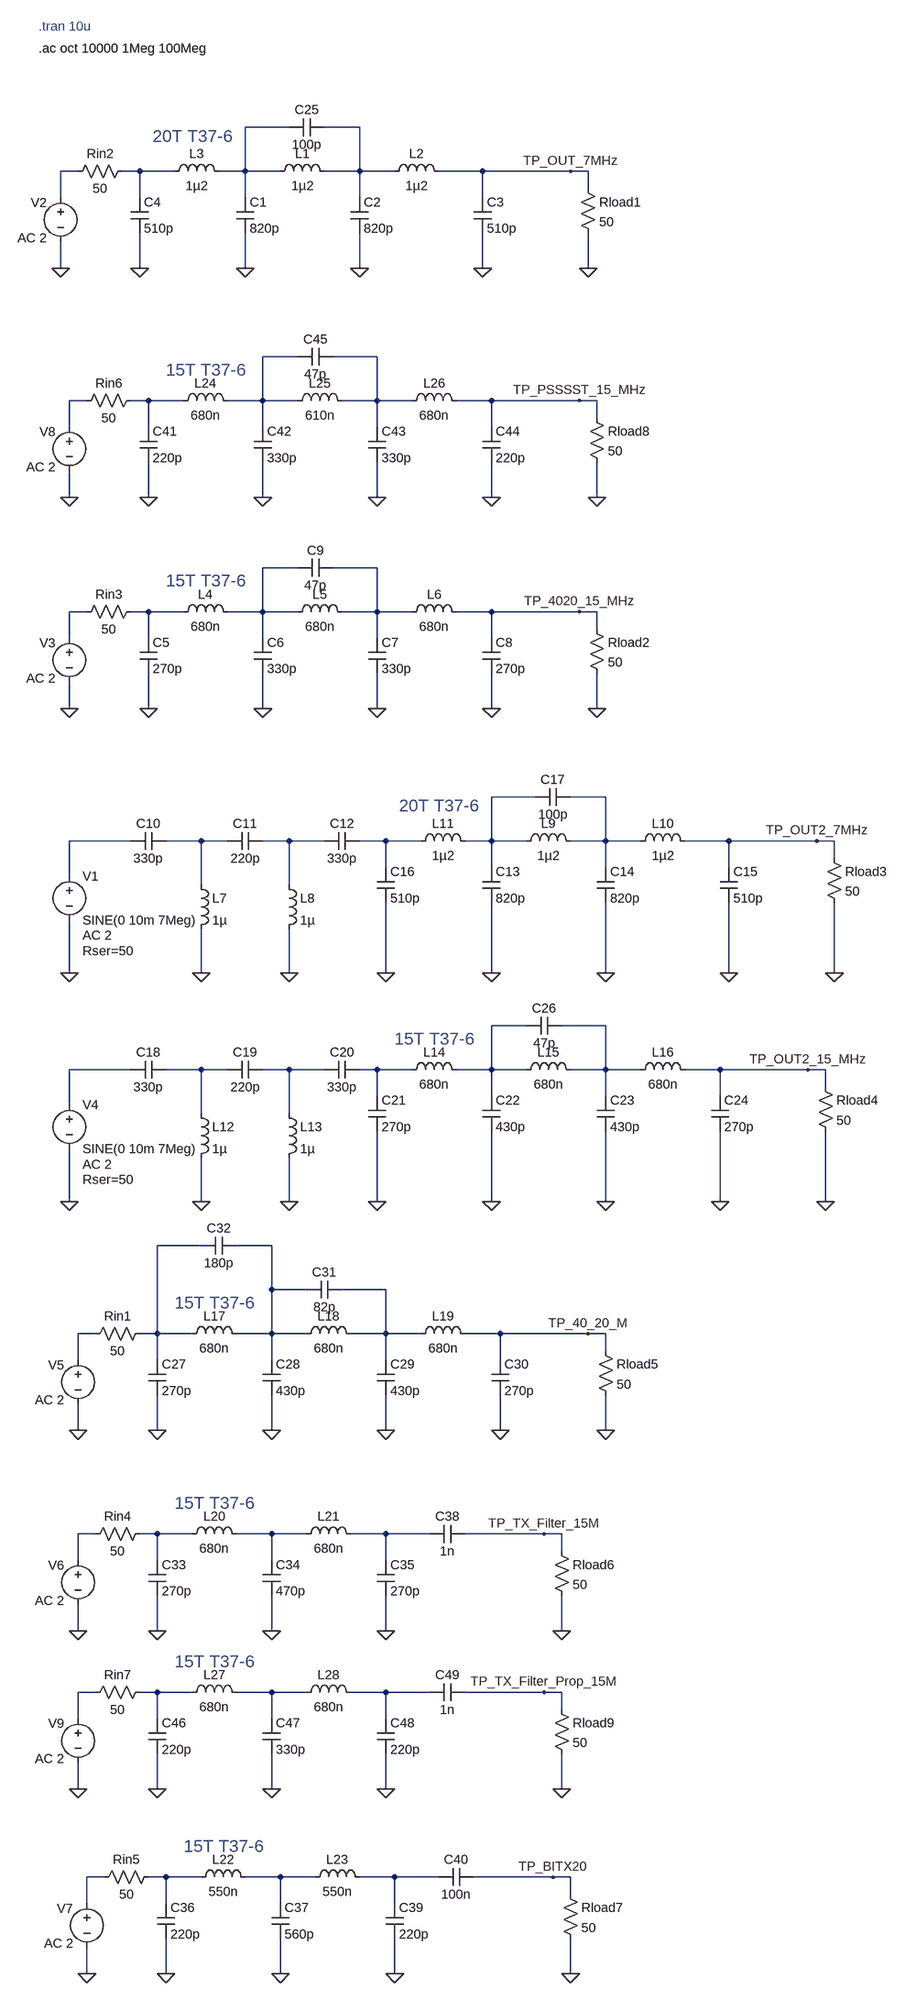
[diagram p0: schematic 4020 LPF Bode 1.asc]
4020 LPF Bode 1.asc, the LTspice schematic file:
Version 4
SHEET 1 1032 2628
WIRE -224 -912 -304 -912
WIRE -96 -912 -160 -912
WIRE -608 -832 -640 -832
WIRE -496 -832 -528 -832
WIRE -432 -832 -496 -832
WIRE -304 -832 -304 -912
WIRE -304 -832 -352 -832
WIRE -240 -832 -304 -832
WIRE -96 -832 -96 -912
WIRE -96 -832 -160 -832
WIRE -32 -832 -96 -832
WIRE 128 -832 48 -832
WIRE 288 -832 128 -832
WIRE 320 -832 288 -832
WIRE 320 -800 320 -832
WIRE -640 -784 -640 -832
WIRE -496 -784 -496 -832
WIRE -304 -784 -304 -832
WIRE -96 -784 -96 -832
WIRE 128 -784 128 -832
WIRE -640 -656 -640 -704
WIRE -496 -656 -496 -720
WIRE -304 -656 -304 -720
WIRE -96 -656 -96 -720
WIRE 128 -656 128 -720
WIRE 320 -656 320 -720
WIRE -208 -480 -272 -480
WIRE -64 -480 -144 -480
WIRE -592 -400 -624 -400
WIRE -480 -400 -512 -400
WIRE -416 -400 -480 -400
WIRE -272 -400 -272 -480
WIRE -272 -400 -336 -400
WIRE -208 -400 -272 -400
WIRE -64 -400 -64 -480
WIRE -64 -400 -128 -400
WIRE 0 -400 -64 -400
WIRE 144 -400 80 -400
WIRE 304 -400 144 -400
WIRE 336 -400 304 -400
WIRE 336 -368 336 -400
WIRE -624 -352 -624 -400
WIRE -480 -352 -480 -400
WIRE -272 -352 -272 -400
WIRE -64 -352 -64 -400
WIRE 144 -352 144 -400
WIRE -624 -224 -624 -272
WIRE -480 -224 -480 -288
WIRE -272 -224 -272 -288
WIRE -64 -224 -64 -288
WIRE 144 -224 144 -288
WIRE 336 -224 336 -288
WIRE -208 -96 -272 -96
WIRE -64 -96 -144 -96
WIRE -592 -16 -624 -16
WIRE -480 -16 -512 -16
WIRE -416 -16 -480 -16
WIRE -272 -16 -272 -96
WIRE -272 -16 -336 -16
WIRE -208 -16 -272 -16
WIRE -64 -16 -64 -96
WIRE -64 -16 -128 -16
WIRE 0 -16 -64 -16
WIRE 144 -16 80 -16
WIRE 304 -16 144 -16
WIRE 336 -16 304 -16
WIRE 336 16 336 -16
WIRE -624 32 -624 -16
WIRE -480 32 -480 -16
WIRE -272 32 -272 -16
WIRE -64 32 -64 -16
WIRE 144 32 144 -16
WIRE -624 160 -624 112
WIRE -480 160 -480 96
WIRE -272 160 -272 96
WIRE -64 160 -64 96
WIRE 144 160 144 96
WIRE 336 160 336 96
WIRE 224 336 144 336
WIRE 352 336 288 336
WIRE -512 416 -624 416
WIRE -384 416 -448 416
WIRE -336 416 -384 416
WIRE -224 416 -272 416
WIRE -160 416 -224 416
WIRE -48 416 -96 416
WIRE 16 416 -48 416
WIRE 144 416 144 336
WIRE 144 416 96 416
WIRE 208 416 144 416
WIRE 352 416 352 336
WIRE 352 416 288 416
WIRE 416 416 352 416
WIRE 576 416 496 416
WIRE 736 416 576 416
WIRE 768 416 736 416
WIRE 768 448 768 416
WIRE -48 464 -48 416
WIRE 144 464 144 416
WIRE 352 464 352 416
WIRE 576 464 576 416
WIRE -624 480 -624 416
WIRE -384 496 -384 416
WIRE -224 496 -224 416
WIRE -624 656 -624 560
WIRE -384 656 -384 576
WIRE -224 656 -224 576
WIRE -48 656 -48 528
WIRE 144 656 144 528
WIRE 352 656 352 528
WIRE 576 656 576 528
WIRE 768 656 768 528
WIRE 208 752 144 752
WIRE 352 752 272 752
WIRE -512 832 -624 832
WIRE -384 832 -448 832
WIRE -336 832 -384 832
WIRE -224 832 -272 832
WIRE -160 832 -224 832
WIRE -64 832 -96 832
WIRE 0 832 -64 832
WIRE 144 832 144 752
WIRE 144 832 80 832
WIRE 208 832 144 832
WIRE 352 832 352 752
WIRE 352 832 288 832
WIRE 416 832 352 832
WIRE 560 832 496 832
WIRE 720 832 560 832
WIRE 752 832 720 832
WIRE 752 864 752 832
WIRE -64 880 -64 832
WIRE 144 880 144 832
WIRE 352 880 352 832
WIRE 560 880 560 832
WIRE -624 896 -624 832
WIRE -384 912 -384 832
WIRE -224 912 -224 832
WIRE -624 1072 -624 976
WIRE -384 1072 -384 992
WIRE -224 1072 -224 992
WIRE -64 1072 -64 944
WIRE 144 1072 144 944
WIRE 352 1072 352 944
WIRE 560 1072 560 944
WIRE 752 1072 752 944
WIRE -384 1152 -464 1152
WIRE -256 1152 -320 1152
WIRE -256 1232 -256 1152
WIRE -192 1232 -256 1232
WIRE -48 1232 -128 1232
WIRE -576 1312 -608 1312
WIRE -464 1312 -464 1152
WIRE -464 1312 -496 1312
WIRE -400 1312 -464 1312
WIRE -256 1312 -256 1232
WIRE -256 1312 -320 1312
WIRE -192 1312 -256 1312
WIRE -48 1312 -48 1232
WIRE -48 1312 -112 1312
WIRE 16 1312 -48 1312
WIRE 160 1312 96 1312
WIRE 320 1312 160 1312
WIRE 352 1312 320 1312
WIRE 352 1344 352 1312
WIRE -608 1360 -608 1312
WIRE -464 1360 -464 1312
WIRE -256 1360 -256 1312
WIRE -48 1360 -48 1312
WIRE 160 1360 160 1312
WIRE -608 1488 -608 1440
WIRE -464 1488 -464 1424
WIRE -256 1488 -256 1424
WIRE -48 1488 -48 1424
WIRE 160 1488 160 1424
WIRE 352 1488 352 1424
WIRE -576 1808 -608 1808
WIRE -464 1808 -496 1808
WIRE -400 1808 -464 1808
WIRE -256 1808 -320 1808
WIRE -192 1808 -256 1808
WIRE -48 1808 -112 1808
WIRE 32 1808 -48 1808
WIRE 240 1808 96 1808
WIRE 272 1808 240 1808
WIRE 272 1840 272 1808
WIRE -608 1856 -608 1808
WIRE -464 1856 -464 1808
WIRE -256 1856 -256 1808
WIRE -48 1856 -48 1808
WIRE -608 1984 -608 1936
WIRE -464 1984 -464 1920
WIRE -256 1984 -256 1920
WIRE -48 1984 -48 1920
WIRE 272 1984 272 1920
WIRE -576 2096 -608 2096
WIRE -464 2096 -496 2096
WIRE -400 2096 -464 2096
WIRE -256 2096 -320 2096
WIRE -192 2096 -256 2096
WIRE -48 2096 -112 2096
WIRE 32 2096 -48 2096
WIRE 240 2096 96 2096
WIRE 272 2096 240 2096
WIRE 272 2128 272 2096
WIRE -608 2144 -608 2096
WIRE -464 2144 -464 2096
WIRE -256 2144 -256 2096
WIRE -48 2144 -48 2096
WIRE -608 2272 -608 2224
WIRE -464 2272 -464 2208
WIRE -256 2272 -256 2208
WIRE -48 2272 -48 2208
WIRE 272 2272 272 2208
WIRE -560 2432 -592 2432
WIRE -448 2432 -480 2432
WIRE -384 2432 -448 2432
WIRE -240 2432 -304 2432
WIRE -176 2432 -240 2432
WIRE -32 2432 -96 2432
WIRE 48 2432 -32 2432
WIRE 256 2432 112 2432
WIRE 288 2432 256 2432
WIRE 288 2464 288 2432
WIRE -592 2480 -592 2432
WIRE -448 2480 -448 2432
WIRE -240 2480 -240 2432
WIRE -32 2480 -32 2432
WIRE -592 2608 -592 2560
WIRE -448 2608 -448 2544
WIRE -240 2608 -240 2544
WIRE -32 2608 -32 2544
WIRE 288 2608 288 2544
FLAG 320 -656 0
FLAG 288 -832 TP_OUT_7MHz
FLAG -304 -656 0
FLAG -96 -656 0
FLAG 128 -656 0
FLAG -496 -656 0
FLAG -480 160 0
FLAG -272 160 0
FLAG -64 160 0
FLAG 336 160 0
FLAG 304 -16 TP_4020_15_MHz
FLAG 144 160 0
FLAG -640 -656 0
FLAG -624 160 0
FLAG -624 656 0
FLAG -224 656 0
FLAG -384 656 0
FLAG 768 656 0
FLAG 736 416 TP_OUT2_7MHz
FLAG 144 656 0
FLAG 352 656 0
FLAG 576 656 0
FLAG -48 656 0
FLAG -624 1072 0
FLAG -224 1072 0
FLAG -384 1072 0
FLAG -64 1072 0
FLAG 144 1072 0
FLAG 352 1072 0
FLAG 752 1072 0
FLAG 720 832 TP_OUT2_15_MHz
FLAG 560 1072 0
FLAG -464 1488 0
FLAG -256 1488 0
FLAG -48 1488 0
FLAG 352 1488 0
FLAG 320 1312 TP_40_20_M
FLAG 160 1488 0
FLAG -608 1488 0
FLAG -464 1984 0
FLAG -256 1984 0
FLAG -48 1984 0
FLAG 272 1984 0
FLAG 240 1808 TP_TX_Filter_15M
FLAG -608 1984 0
FLAG -448 2608 0
FLAG -240 2608 0
FLAG -32 2608 0
FLAG 288 2608 0
FLAG 256 2432 TP_BITX20
FLAG -592 2608 0
FLAG -480 -224 0
FLAG -272 -224 0
FLAG -64 -224 0
FLAG 336 -224 0
FLAG 304 -400 TP_PSSSST_15_MHz
FLAG 144 -224 0
FLAG -624 -224 0
FLAG -464 2272 0
FLAG -256 2272 0
FLAG -48 2272 0
FLAG 272 2272 0
FLAG 240 2096 TP_TX_Filter_Prop_15M
FLAG -608 2272 0
SYMBOL res 304 -816 R0
SYMATTR InstName Rload1
SYMATTR Value 50
SYMBOL cap -320 -784 R0
SYMATTR InstName C1
SYMATTR Value 820p
SYMBOL cap -112 -784 R0
SYMATTR InstName C2
SYMATTR Value 820p
SYMBOL ind -256 -816 R270
WINDOW 0 32 56 VTop 2
WINDOW 3 5 56 VBottom 2
SYMATTR InstName L1
SYMATTR Value 1µ2
SYMATTR SpiceLine Rser=80m
SYMBOL ind -48 -816 R270
WINDOW 0 32 56 VTop 2
WINDOW 3 5 56 VBottom 2
SYMATTR InstName L2
SYMATTR Value 1µ2
SYMATTR SpiceLine Rser=80m
SYMBOL cap 112 -784 R0
SYMATTR InstName C3
SYMATTR Value 510p
SYMBOL cap -512 -784 R0
SYMATTR InstName C4
SYMATTR Value 510p
SYMBOL ind -448 -816 R270
WINDOW 0 32 56 VTop 2
WINDOW 3 5 56 VBottom 2
SYMATTR InstName L3
SYMATTR Value 1µ2
SYMATTR SpiceLine Rser=80m
SYMBOL cap -496 32 R0
SYMATTR InstName C5
SYMATTR Value 270p
SYMBOL cap -288 32 R0
SYMATTR InstName C6
SYMATTR Value 330p
SYMBOL ind -432 0 R270
WINDOW 0 32 56 VTop 2
WINDOW 3 5 56 VBottom 2
SYMATTR InstName L4
SYMATTR Value 680n
SYMBOL ind -224 0 R270
WINDOW 0 32 56 VTop 2
WINDOW 3 5 56 VBottom 2
SYMATTR InstName L5
SYMATTR Value 680n
SYMBOL cap -80 32 R0
SYMATTR InstName C7
SYMATTR Value 330p
SYMBOL res 320 0 R0
SYMATTR InstName Rload2
SYMATTR Value 50
SYMBOL ind -16 0 R270
WINDOW 0 32 56 VTop 2
WINDOW 3 5 56 VBottom 2
SYMATTR InstName L6
SYMATTR Value 680n
SYMBOL cap 128 32 R0
SYMATTR InstName C8
SYMATTR Value 270p
SYMBOL cap -144 -112 R90
WINDOW 0 0 32 VBottom 2
WINDOW 3 32 32 VTop 2
SYMATTR InstName C9
SYMATTR Value 47p
SYMBOL voltage -640 -800 M0
WINDOW 123 25 89 Left 2
WINDOW 39 0 0 Left 2
WINDOW 0 25 25 Left 2
WINDOW 3 24 104 Invisible 2
SYMATTR Value2 AC 2
SYMATTR InstName V2
SYMATTR Value SINE(0 63 7.1Meg)
SYMBOL res -624 -816 R270
WINDOW 0 32 56 VTop 2
WINDOW 3 0 56 VBottom 2
SYMATTR InstName Rin2
SYMATTR Value 50
SYMBOL voltage -624 16 M0
WINDOW 123 25 89 Left 2
WINDOW 39 0 0 Left 2
WINDOW 0 25 25 Left 2
WINDOW 3 24 104 Invisible 2
SYMATTR Value2 AC 2
SYMATTR InstName V3
SYMATTR Value SINE(0 63 14Meg)
SYMBOL res -608 0 R270
WINDOW 0 32 56 VTop 2
WINDOW 3 0 56 VBottom 2
SYMATTR InstName Rin3
SYMATTR Value 50
SYMBOL cap -160 -928 R90
WINDOW 0 0 32 VBottom 2
WINDOW 3 32 32 VTop 2
SYMATTR InstName C25
SYMATTR Value 100p
SYMBOL voltage -624 464 R0
WINDOW 123 24 124 Left 2
WINDOW 39 24 152 Left 2
SYMATTR Value2 AC 2
SYMATTR SpiceLine Rser=50
SYMATTR InstName V1
SYMATTR Value SINE(0 10m 7Meg)
SYMBOL cap -448 400 R90
WINDOW 0 0 32 VBottom 2
WINDOW 3 32 32 VTop 2
SYMATTR InstName C10
SYMATTR Value 330p
SYMBOL ind -400 480 R0
SYMATTR InstName L7
SYMATTR Value 1µ
SYMBOL cap -272 400 R90
WINDOW 0 0 32 VBottom 2
WINDOW 3 32 32 VTop 2
SYMATTR InstName C11
SYMATTR Value 220p
SYMBOL cap -96 400 R90
WINDOW 0 0 32 VBottom 2
WINDOW 3 32 32 VTop 2
SYMATTR InstName C12
SYMATTR Value 330p
SYMBOL ind -240 480 R0
SYMATTR InstName L8
SYMATTR Value 1µ
SYMBOL res 752 432 R0
SYMATTR InstName Rload3
SYMATTR Value 50
SYMBOL cap 128 464 R0
SYMATTR InstName C13
SYMATTR Value 820p
SYMBOL cap 336 464 R0
SYMATTR InstName C14
SYMATTR Value 820p
SYMBOL ind 192 432 R270
WINDOW 0 32 56 VTop 2
WINDOW 3 5 56 VBottom 2
SYMATTR InstName L9
SYMATTR Value 1µ2
SYMATTR SpiceLine Rser=80m
SYMBOL ind 400 432 R270
WINDOW 0 32 56 VTop 2
WINDOW 3 5 56 VBottom 2
SYMATTR InstName L10
SYMATTR Value 1µ2
SYMATTR SpiceLine Rser=80m
SYMBOL cap 560 464 R0
SYMATTR InstName C15
SYMATTR Value 510p
SYMBOL cap -64 464 R0
SYMATTR InstName C16
SYMATTR Value 510p
SYMBOL ind 0 432 R270
WINDOW 0 32 56 VTop 2
WINDOW 3 5 56 VBottom 2
SYMATTR InstName L11
SYMATTR Value 1µ2
SYMATTR SpiceLine Rser=80m
SYMBOL cap 288 320 R90
WINDOW 0 0 32 VBottom 2
WINDOW 3 32 32 VTop 2
SYMATTR InstName C17
SYMATTR Value 100p
SYMBOL voltage -624 880 R0
WINDOW 123 24 124 Left 2
WINDOW 39 24 152 Left 2
SYMATTR Value2 AC 2
SYMATTR SpiceLine Rser=50
SYMATTR InstName V4
SYMATTR Value SINE(0 10m 7Meg)
SYMBOL cap -448 816 R90
WINDOW 0 0 32 VBottom 2
WINDOW 3 32 32 VTop 2
SYMATTR InstName C18
SYMATTR Value 330p
SYMBOL ind -400 896 R0
SYMATTR InstName L12
SYMATTR Value 1µ
SYMBOL cap -272 816 R90
WINDOW 0 0 32 VBottom 2
WINDOW 3 32 32 VTop 2
SYMATTR InstName C19
SYMATTR Value 220p
SYMBOL cap -96 816 R90
WINDOW 0 0 32 VBottom 2
WINDOW 3 32 32 VTop 2
SYMATTR InstName C20
SYMATTR Value 330p
SYMBOL ind -240 896 R0
SYMATTR InstName L13
SYMATTR Value 1µ
SYMBOL cap -80 880 R0
SYMATTR InstName C21
SYMATTR Value 270p
SYMBOL cap 128 880 R0
SYMATTR InstName C22
SYMATTR Value 430p
SYMBOL ind -16 848 R270
WINDOW 0 32 56 VTop 2
WINDOW 3 5 56 VBottom 2
SYMATTR InstName L14
SYMATTR Value 680n
SYMBOL ind 192 848 R270
WINDOW 0 32 56 VTop 2
WINDOW 3 5 56 VBottom 2
SYMATTR InstName L15
SYMATTR Value 680n
SYMBOL cap 336 880 R0
SYMATTR InstName C23
SYMATTR Value 430p
SYMBOL res 736 848 R0
SYMATTR InstName Rload4
SYMATTR Value 50
SYMBOL ind 400 848 R270
WINDOW 0 32 56 VTop 2
WINDOW 3 5 56 VBottom 2
SYMATTR InstName L16
SYMATTR Value 680n
SYMBOL cap 544 880 R0
SYMATTR InstName C24
SYMATTR Value 270p
SYMBOL cap 272 736 R90
WINDOW 0 0 32 VBottom 2
WINDOW 3 32 32 VTop 2
SYMATTR InstName C26
SYMATTR Value 47p
SYMBOL cap -480 1360 R0
SYMATTR InstName C27
SYMATTR Value 270p
SYMBOL cap -272 1360 R0
SYMATTR InstName C28
SYMATTR Value 430p
SYMBOL ind -416 1328 R270
WINDOW 0 32 56 VTop 2
WINDOW 3 5 56 VBottom 2
SYMATTR InstName L17
SYMATTR Value 680n
SYMBOL ind -208 1328 R270
WINDOW 0 32 56 VTop 2
WINDOW 3 5 56 VBottom 2
SYMATTR InstName L18
SYMATTR Value 680n
SYMBOL cap -64 1360 R0
SYMATTR InstName C29
SYMATTR Value 430p
SYMBOL res 336 1328 R0
SYMATTR InstName Rload5
SYMATTR Value 50
SYMBOL ind 0 1328 R270
WINDOW 0 32 56 VTop 2
WINDOW 3 5 56 VBottom 2
SYMATTR InstName L19
SYMATTR Value 680n
SYMBOL cap 144 1360 R0
SYMATTR InstName C30
SYMATTR Value 270p
SYMBOL cap -128 1216 R90
WINDOW 0 0 32 VBottom 2
WINDOW 3 32 32 VTop 2
SYMATTR InstName C31
SYMATTR Value 82p
SYMBOL voltage -608 1344 M0
WINDOW 123 25 89 Left 2
WINDOW 39 0 0 Left 2
WINDOW 0 25 25 Left 2
WINDOW 3 24 104 Invisible 2
SYMATTR Value2 AC 2
SYMATTR InstName V5
SYMATTR Value SINE(0 30 28Meg)
SYMBOL res -592 1328 R270
WINDOW 0 32 56 VTop 2
WINDOW 3 0 56 VBottom 2
SYMATTR InstName Rin1
SYMATTR Value 50
SYMBOL cap -320 1136 R90
WINDOW 0 0 32 VBottom 2
WINDOW 3 32 32 VTop 2
SYMATTR InstName C32
SYMATTR Value 180p
SYMBOL cap -480 1856 R0
SYMATTR InstName C33
SYMATTR Value 270p
SYMBOL cap -272 1856 R0
SYMATTR InstName C34
SYMATTR Value 470p
SYMBOL ind -416 1824 R270
WINDOW 0 32 56 VTop 2
WINDOW 3 5 56 VBottom 2
SYMATTR InstName L20
SYMATTR Value 680n
SYMBOL ind -208 1824 R270
WINDOW 0 32 56 VTop 2
WINDOW 3 5 56 VBottom 2
SYMATTR InstName L21
SYMATTR Value 680n
SYMBOL cap -64 1856 R0
SYMATTR InstName C35
SYMATTR Value 270p
SYMBOL res 256 1824 R0
SYMATTR InstName Rload6
SYMATTR Value 50
SYMBOL voltage -608 1840 M0
WINDOW 123 25 89 Left 2
WINDOW 39 0 0 Left 2
WINDOW 0 25 25 Left 2
WINDOW 3 24 104 Invisible 2
SYMATTR Value2 AC 2
SYMATTR InstName V6
SYMATTR Value SINE(0 30 28Meg)
SYMBOL res -592 1824 R270
WINDOW 0 32 56 VTop 2
WINDOW 3 0 56 VBottom 2
SYMATTR InstName Rin4
SYMATTR Value 50
SYMBOL cap 96 1792 R90
WINDOW 0 0 32 VBottom 2
WINDOW 3 32 32 VTop 2
SYMATTR InstName C38
SYMATTR Value 1n
SYMBOL cap -464 2480 R0
SYMATTR InstName C36
SYMATTR Value 220p
SYMBOL cap -256 2480 R0
SYMATTR InstName C37
SYMATTR Value 560p
SYMBOL ind -400 2448 R270
WINDOW 0 32 56 VTop 2
WINDOW 3 5 56 VBottom 2
SYMATTR InstName L22
SYMATTR Value 550n
SYMBOL ind -192 2448 R270
WINDOW 0 32 56 VTop 2
WINDOW 3 5 56 VBottom 2
SYMATTR InstName L23
SYMATTR Value 550n
SYMBOL cap -48 2480 R0
SYMATTR InstName C39
SYMATTR Value 220p
SYMBOL res 272 2448 R0
SYMATTR InstName Rload7
SYMATTR Value 50
SYMBOL voltage -592 2464 M0
WINDOW 123 25 89 Left 2
WINDOW 39 0 0 Left 2
WINDOW 0 25 25 Left 2
WINDOW 3 24 104 Invisible 2
SYMATTR Value2 AC 2
SYMATTR InstName V7
SYMATTR Value SINE(0 30 28Meg)
SYMBOL res -576 2448 R270
WINDOW 0 32 56 VTop 2
WINDOW 3 0 56 VBottom 2
SYMATTR InstName Rin5
SYMATTR Value 50
SYMBOL cap 112 2416 R90
WINDOW 0 0 32 VBottom 2
WINDOW 3 32 32 VTop 2
SYMATTR InstName C40
SYMATTR Value 100n
SYMBOL cap -496 -352 R0
SYMATTR InstName C41
SYMATTR Value 220p
SYMBOL cap -288 -352 R0
SYMATTR InstName C42
SYMATTR Value 330p
SYMBOL ind -432 -384 R270
WINDOW 0 32 56 VTop 2
WINDOW 3 5 56 VBottom 2
SYMATTR InstName L24
SYMATTR Value 680n
SYMBOL ind -224 -384 R270
WINDOW 0 32 56 VTop 2
WINDOW 3 5 56 VBottom 2
SYMATTR InstName L25
SYMATTR Value 610n
SYMBOL cap -80 -352 R0
SYMATTR InstName C43
SYMATTR Value 330p
SYMBOL res 320 -384 R0
SYMATTR InstName Rload8
SYMATTR Value 50
SYMBOL ind -16 -384 R270
WINDOW 0 32 56 VTop 2
WINDOW 3 5 56 VBottom 2
SYMATTR InstName L26
SYMATTR Value 680n
SYMBOL cap 128 -352 R0
SYMATTR InstName C44
SYMATTR Value 220p
SYMBOL cap -144 -496 R90
WINDOW 0 0 32 VBottom 2
WINDOW 3 32 32 VTop 2
SYMATTR InstName C45
SYMATTR Value 47p
SYMBOL voltage -624 -368 M0
WINDOW 123 25 89 Left 2
WINDOW 39 0 0 Left 2
WINDOW 0 25 25 Left 2
WINDOW 3 24 104 Invisible 2
SYMATTR Value2 AC 2
SYMATTR InstName V8
SYMATTR Value SINE(0 63 14Meg)
SYMBOL res -608 -384 R270
WINDOW 0 32 56 VTop 2
WINDOW 3 0 56 VBottom 2
SYMATTR InstName Rin6
SYMATTR Value 50
SYMBOL cap -480 2144 R0
SYMATTR InstName C46
SYMATTR Value 220p
SYMBOL cap -272 2144 R0
SYMATTR InstName C47
SYMATTR Value 330p
SYMBOL ind -416 2112 R270
WINDOW 0 32 56 VTop 2
WINDOW 3 5 56 VBottom 2
SYMATTR InstName L27
SYMATTR Value 680n
SYMBOL ind -208 2112 R270
WINDOW 0 32 56 VTop 2
WINDOW 3 5 56 VBottom 2
SYMATTR InstName L28
SYMATTR Value 680n
SYMBOL cap -64 2144 R0
SYMATTR InstName C48
SYMATTR Value 220p
SYMBOL res 256 2112 R0
SYMATTR InstName Rload9
SYMATTR Value 50
SYMBOL voltage -608 2128 M0
WINDOW 123 25 89 Left 2
WINDOW 39 0 0 Left 2
WINDOW 0 25 25 Left 2
WINDOW 3 24 104 Invisible 2
SYMATTR Value2 AC 2
SYMATTR InstName V9
SYMATTR Value SINE(0 30 28Meg)
SYMBOL res -592 2112 R270
WINDOW 0 32 56 VTop 2
WINDOW 3 0 56 VBottom 2
SYMATTR InstName Rin7
SYMATTR Value 50
SYMBOL cap 96 2080 R90
WINDOW 0 0 32 VBottom 2
WINDOW 3 32 32 VTop 2
SYMATTR InstName C49
SYMATTR Value 1n
TEXT -448 -72 Left 3 ;15T T37-6
TEXT -680 -1056 Left 2 !.ac oct 10000 1Meg 100Meg
TEXT -680 -1096 Left 2 ;.tran 10u
TEXT -472 -896 Left 3 ;20T T37-6
TEXT -24 352 Left 3 ;20T T37-6
TEXT -32 776 Left 3 ;15T T37-6
TEXT -432 1256 Left 3 ;15T T37-6
TEXT -432 1752 Left 3 ;15T T37-6
TEXT -416 2376 Left 3 ;15T T37-6
TEXT -448 -456 Left 3 ;15T T37-6
TEXT -432 2040 Left 3 ;15T T37-6

The netlist it stands for:
* 4020 LPF Bode 1.asc
Rload1 TP_OUT_7MHz 0 50
C1 N001 0 820p
C2 N002 0 820p
L1 N001 N002 1µ2 Rser=80m
L2 N002 TP_OUT_7MHz 1µ2 Rser=80m
C3 TP_OUT_7MHz 0 510p
C4 N004 0 510p
L3 N004 N001 1µ2 Rser=80m
C5 N012 0 270p
C6 N009 0 330p
L4 N012 N009 680n
L5 N009 N010 680n
C7 N010 0 330p
Rload2 TP_4020_15_MHz 0 50
L6 N010 TP_4020_15_MHz 680n
C8 TP_4020_15_MHz 0 270p
C9 N010 N009 47p
V2 N003 0 SINE(0 63 7.1Meg) AC 2
Rin2 N003 N004 50
V3 N011 0 SINE(0 63 14Meg) AC 2
Rin3 N011 N012 50
C25 N002 N001 100p
V1 N015 0 SINE(0 10m 7Meg) AC 2 Rser=50
C10 N016 N015 330p
L7 N016 0 1µ
C11 N017 N016 220p
C12 N018 N017 330p
L8 N017 0 1µ
Rload3 TP_OUT2_7MHz 0 50
C13 N013 0 820p
C14 N014 0 820p
L9 N013 N014 1µ2 Rser=80m
L10 N014 TP_OUT2_7MHz 1µ2 Rser=80m
C15 TP_OUT2_7MHz 0 510p
C16 N018 0 510p
L11 N018 N013 1µ2 Rser=80m
C17 N014 N013 100p
V4 N021 0 SINE(0 10m 7Meg) AC 2 Rser=50
C18 N022 N021 330p
L12 N022 0 1µ
C19 N023 N022 220p
C20 N024 N023 330p
L13 N023 0 1µ
C21 N024 0 270p
C22 N019 0 430p
L14 N024 N019 680n
L15 N019 N020 680n
C23 N020 0 430p
Rload4 TP_OUT2_15_MHz 0 50
L16 N020 TP_OUT2_15_MHz 680n
C24 TP_OUT2_15_MHz 0 270p
C26 N020 N019 47p
C27 N025 0 270p
C28 N026 0 430p
L17 N025 N026 680n
L18 N026 N027 680n
C29 N027 0 430p
Rload5 TP_40_20_M 0 50
L19 N027 TP_40_20_M 680n
C30 TP_40_20_M 0 270p
C31 N027 N026 82p
V5 N028 0 SINE(0 30 28Meg) AC 2
Rin1 N028 N025 50
C32 N026 N025 180p
C33 N030 0 270p
C34 N031 0 470p
L20 N030 N031 680n
L21 N031 N032 680n
C35 N032 0 270p
Rload6 TP_TX_Filter_15M 0 50
V6 N029 0 SINE(0 30 28Meg) AC 2
Rin4 N029 N030 50
C38 TP_TX_Filter_15M N032 1n
C36 N038 0 220p
C37 N039 0 560p
L22 N038 N039 550n
L23 N039 N040 550n
C39 N040 0 220p
Rload7 TP_BITX20 0 50
V7 N037 0 SINE(0 30 28Meg) AC 2
Rin5 N037 N038 50
C40 TP_BITX20 N040 100n
C41 N008 0 220p
C42 N005 0 330p
L24 N008 N005 680n
L25 N005 N006 610n
C43 N006 0 330p
Rload8 TP_PSSSST_15_MHz 0 50
L26 N006 TP_PSSSST_15_MHz 680n
C44 TP_PSSSST_15_MHz 0 220p
C45 N006 N005 47p
V8 N007 0 SINE(0 63 14Meg) AC 2
Rin6 N007 N008 50
C46 N034 0 220p
C47 N035 0 330p
L27 N034 N035 680n
L28 N035 N036 680n
C48 N036 0 220p
Rload9 TP_TX_Filter_Prop_15M 0 50
V9 N033 0 SINE(0 30 28Meg) AC 2
Rin7 N033 N034 50
C49 TP_TX_Filter_Prop_15M N036 1n
* 15T T37-6
.ac oct 10000 1Meg 100Meg
* .tran 10u
* 20T T37-6
* 20T T37-6
* 15T T37-6
* 15T T37-6
* 15T T37-6
* 15T T37-6
* 15T T37-6
* 15T T37-6
.backanno
.end